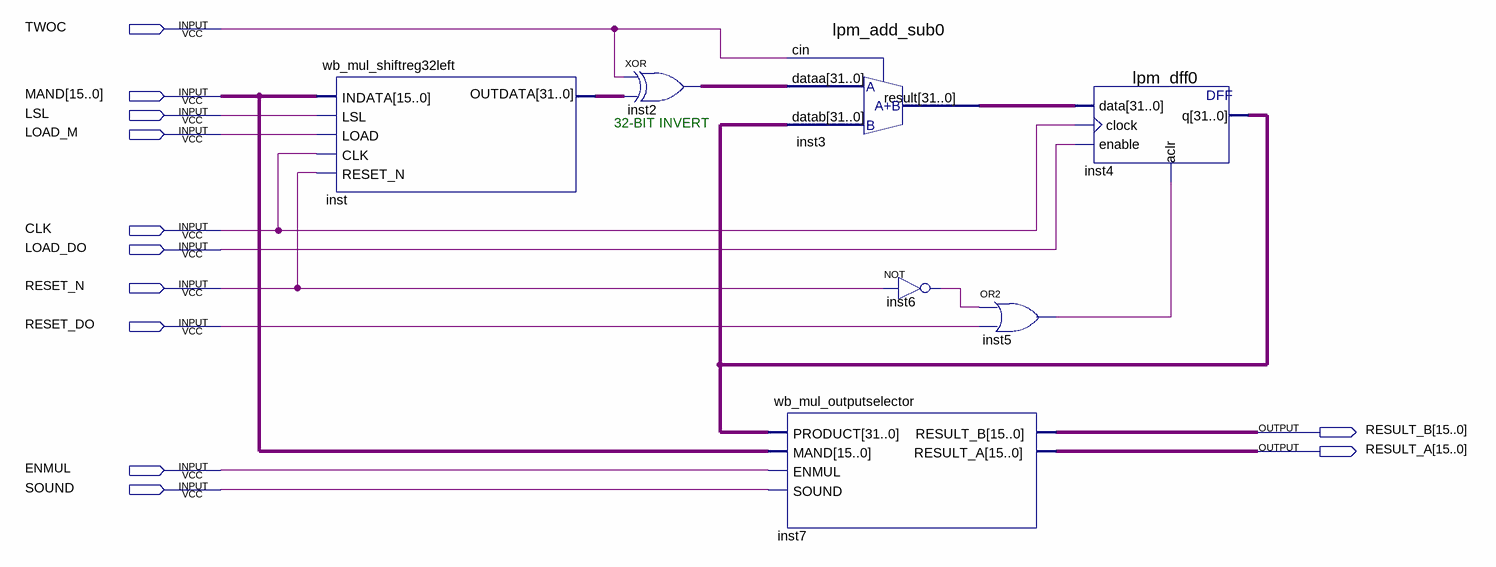
[diagram p0: schematic sheet]
// Quartus schematic mul_data_path.bdf as structural Verilog: 7 symbols, 12 pins
module mul_data_path (
  input  TWOC,
  input  [15:0] MAND,
  input  LSL,
  input  LOAD_M,
  input  CLK,
  input  LOAD_DO,
  input  RESET_N,
  input  RESET_DO,
  input  ENMUL,
  input  SOUND,
  output [15:0] RESULT_B,
  output [15:0] RESULT_A
);

  wire inst5_out, inst6_out;
  wire [31:0] inst2_out, inst3_result, inst4_q, inst_outdata;

  wb_mul_shiftreg32left inst (
    .INDATA(MAND), .LSL(LSL), .CLK(CLK), .RESET_N(RESET_N), .LOAD(LOAD_M), .OUTDATA(inst_outdata));
  assign inst2_out = {32{TWOC}} ^ inst_outdata;  // XOR inst2, 32 bits wide
  lpm_add_sub0 inst3 (.dataa(inst2_out), .datab(inst4_q), .cin(TWOC), .result(inst3_result));
  wb_mul_outputselector inst7 (
    .PRODUCT(inst4_q), .MAND(MAND), .ENMUL(ENMUL), .SOUND(SOUND), .RESULT_B(RESULT_B), .RESULT_A(RESULT_A));
  not inst6 (inst6_out, RESET_N);
  or inst5 (inst5_out, inst6_out, RESET_DO);
  lpm_dff0 inst4 (.data(inst3_result), .clock(CLK), .enable(LOAD_DO), .aclr(inst5_out), .q(inst4_q));

  // Notes on the sheet:
  //   32-BIT INVERT
endmodule
